# Altium project BNO055_BreakOut.PrjPcb
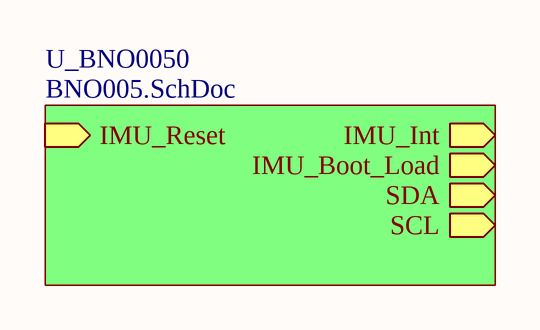
[diagram p0: Main.SchDoc]
2 sheets, 8 parts. Net scope: hierarchical (ports join the sheet entries above them; power ports are global).
Board file: PCB1.PcbDoc
Sheets:
  Main.SchDoc
    U_BNO0050 = BNO005.SchDoc

## Sheet Main.SchDoc
size A4; SheetNumber: 1; SheetTotal: 2

### Sub-sheets
U_BNO0050 = BNO005.SchDoc: IMU_Reset (in), IMU_Int (out), IMU_Boot_Load (out), SDA (out), SCL (out)

## Sheet BNO005.SchDoc
size A4; SheetNumber: 2; SheetTotal: 2
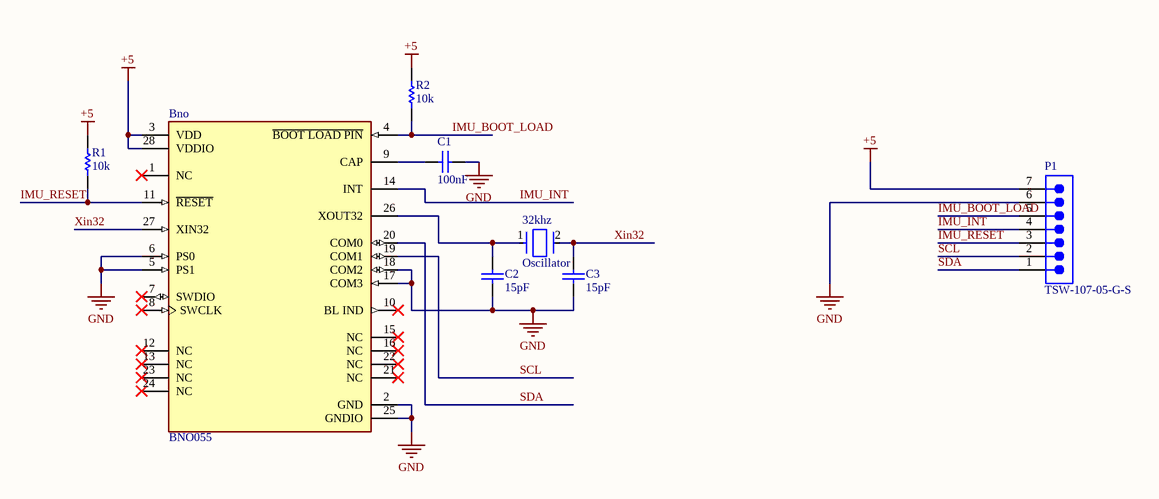
[diagram p1: BNO005.SchDoc]

### Parts
32khz  Oscillator  [FP-NX2012SA-MFG]
Bno  BNO055  [FP-BNO055-MFG]
C1  100nF  [CAPC1608X90X35ML10T15]
C2  15pF  [CAPC1608X90X35ML10T15]
C3  15pF  [CAPC1608X90X35ML10T15]
P1  TSW-107-05-G-S  [SMTC-TSW-107-05-X-S]
R1  10k  [RESC1609X55X30LL15T15]
R2  10k  [RESC1609X55X30LL15T15]

### Nets
+5: Bno.3(VDD) Bno.28(VDDIO) P1.7 R1.2 R2.2
GND: Bno.2(GND) Bno.5(PS1) Bno.6(PS0) Bno.17(COM3) Bno.18(COM2) Bno.25(GNDIO) C1.2 C2.1 C3.1 P1.6
IMU_BOOT_LOAD: Bno.4(~{BOOT_LOAD_PIN}) P1.5 R2.1
IMU_INT: Bno.14(INT) P1.4
IMU_RESET: Bno.11(~{RESET}) P1.3 R1.1
SCL: Bno.19(COM1) P1.2
SDA: Bno.20(COM0) P1.1
Xin32: 32khz.2 Bno.27(XIN32) C3.2
Net32khz_1: 32khz.1 Bno.26(XOUT32) C2.2
NetBno_9: Bno.9(CAP) C1.1

Not connected (* = marked no-connect by the designer): Bno 1(NC)* 7(SWDIO)* 8(SWCLK)* 10(BL_IND)* 12(NC)* 13(NC)* 15(NC)* 16(NC)* 21(NC)* 22(NC)* 23(NC)* 24(NC)*

### Library data of the parts
32khz = CMP-200220-000019-1: CRYSTAL 32.7680KHZ 12.5PF SMD; Frequency Tolerance: 20ppm; ESR (Equivalent Series Resistance): 80kR; Frequency: 32.768kHz; Mount: Surface Mount; Packaging: Cut Tape; Min Operating Temperature: -40°C; Max Operating Temperature: 85°C; Case/Package: SMD/SMT; RoHS Compliant: Yes; Length: 0.081inch; Series: NX2012SA; Height: 0.024inch; Width: 0.047inch; Load Capacitance: 12.5pF
Bno = CMP-2000-05075-4: IMU ACCEL/GYRO/MAG I2C 28LGA; Sensor Type: Accelerometer; Packaging: Tape and Reel; Case/Package: LGA; Min Operating Temperature: -40°C; Mount: Surface Mount; Output Type: I2C; Lead Free: Lead Free; Max Operating Temperature: 85°C
C1 = CMP-2100-03643-1: Chip Capacitor, 0.1 uF, +/- 10%, 50 V, -55 to 125 degC, 0603 (1608 Metric), RoHS, Tape and Reel; Manufacturer: Murata; Dielectric Material: Ceramic; Voltage Rating: 50V; Dielectric: X7R; Insulation Resistance: 10GR; Case Code (Metric): 1608; Lead Free: LeadFree; Depth: 0.8mm; Number of Pins: 2; Radiation Hardening: No; Case/Package: 0603; Manufacturer URL: http://www.murata.com/; Packaging: TapeandReel; Length: 1.6mm; Contact Plating: Tin; Datasheet URL: http://psearch.en.murata.com/capacitor/product/GRM188R71H104KA93%23.pdf; Tolerance: 10%; Case Code (Imperial): 0603; Min Operating Temperature: -55degC; RoHSCompliant: true; Capacitance: 100nF; Voltage: 50V; Termination: SMD/SMT; Mount: SurfaceMount; Material: Ceramic; Package Quantity: 1; Height: 0.8mm; Thickness: 0.035inch; REACH SVHC: NoSVHC; Max Operating Temperature: 125degC; Width: 0.8mm; Package Reference: 0603; Voltage Rating (DC): 50V; Datasheet Version: 42675.0; Package Description: 2-Pin Surface Mount Device, Body 1.6 x 0.8 mm
C2 C3 = CMP-2006-02610-1: Part Number: GRM1885C1H150JA01D; Manufacturer: Murata
P1 = CMP-1024-00400-1: 0.025" SQ Post Header, Through-hole, Vertical, -55 to 125 degC, 2.54 mm Pitch, 7-Pin, Male, RoHS; Manufacturer: Samtec; Pitch: 2.54 mm; PackageReference: TSW-107-05-X-S; Orientation: Vertical; ComponentLink2Description: Datasheet; Mounting Technology: Through-hole; PackageDescription: .025[0.64] SQ. Post Terminal Strip Assembly; PackageVersion: DM, 8/1988; RoHS: True; ComponentLink1Description: Manufacturer URL; ComponentLink2URL: http://www.samtec.com/documents/webfiles/pdf/TSW_TH.PDF; PartNumber: TSW-107-05-G-S; DatasheetVersion: F-214; ComponentLink3URL: http://www.samtec.com/documents/webfiles/cpdf/TSW-XXX-XX-XXX-X-XX-XXX-MKT.pdf; ComponentLink1URL: http://www.samtec.com; ComponentLink3Description: Package Specification; Temperature Range: -55 to 125 degC
R1 R2 = CMP-1012-00623-3: Chip Resistor, 10 KOhm, +/- 1%, 0.1 W, -55 to 155 degC, 0603 (1608 Metric), RoHS, Tape and Reel; Manufacturer: Panasonic; Voltage Rating: 75V; Case\/Package: 0603; Power Rating: 100mW; Resistance: 10KOhm; Temperature Coefficient: 100ppm\/degreesC; Number of Pins: 2; Package Reference: 603; Depth: 0.8mm; Mount: SurfaceMount; Package Description: 2-Pin Surface Mount Device, Body 1.6 x 0.85 mm; Datasheet Version: 02/2017; Length: 1.6mm; Lead Free: LeadFree; Height: 0.45mm; Number of Terminations: 2; Max Power Dissipation: 100mW; Min Operating Temperature: -55degC; Datasheet URL: https://industrial.panasonic.com/cdbs/www-data/pdf/RDA0000/AOA0000C304.pdf; Termination: SMD/SMT; Case Code (Metric): 1608; Case Code (Imperial): 0603; Tolerance: 1%; Max Operating Temperature: 155degC; RoHSCompliant: true; Voltage Rating (DC): 75V; Radiation Hardening: No; Packaging: TapeandReel; Composition: ThickFilm; Mounting Technology: SurfaceMount; Manufacturer URL: http://www.panasonic.com/; Width: 0.031inch; REACH SVHC: NoSVHC; Contact Plating: Tin; Military Standard: Not; Package Quantity: 1